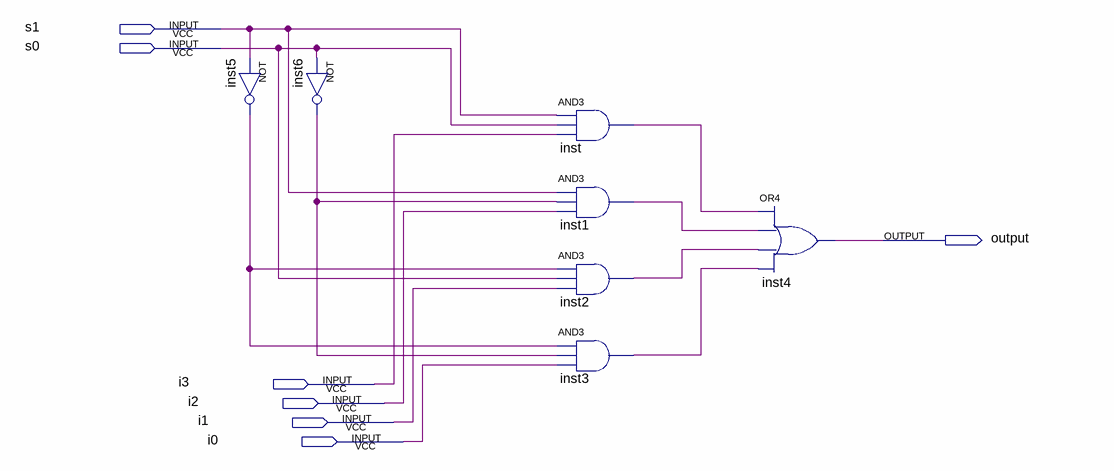
[diagram p0: schematic sheet]
// Quartus schematic Mux4to1.bdf as structural Verilog: 7 symbols, 7 pins
module Mux4to1 (
  input  s1,
  input  s0,
  input  i3,
  input  i2,
  input  i1,
  input  i0,
  output \output 
);

  wire inst1_out, inst2_out, inst3_out, inst5_out, inst6_out, inst_out;

  not inst5 (inst5_out, s1);
  not inst6 (inst6_out, s0);
  and inst (inst_out, s1, s0, i3);
  and inst1 (inst1_out, s1, inst6_out, i2);
  and inst2 (inst2_out, inst5_out, s0, i1);
  and inst3 (inst3_out, inst5_out, inst6_out, i0);
  or inst4 (\output , inst_out, inst1_out, inst2_out, inst3_out);
endmodule
